# EAGLE design nanoDimmerTouchPad (EAGLE 9.4.2)
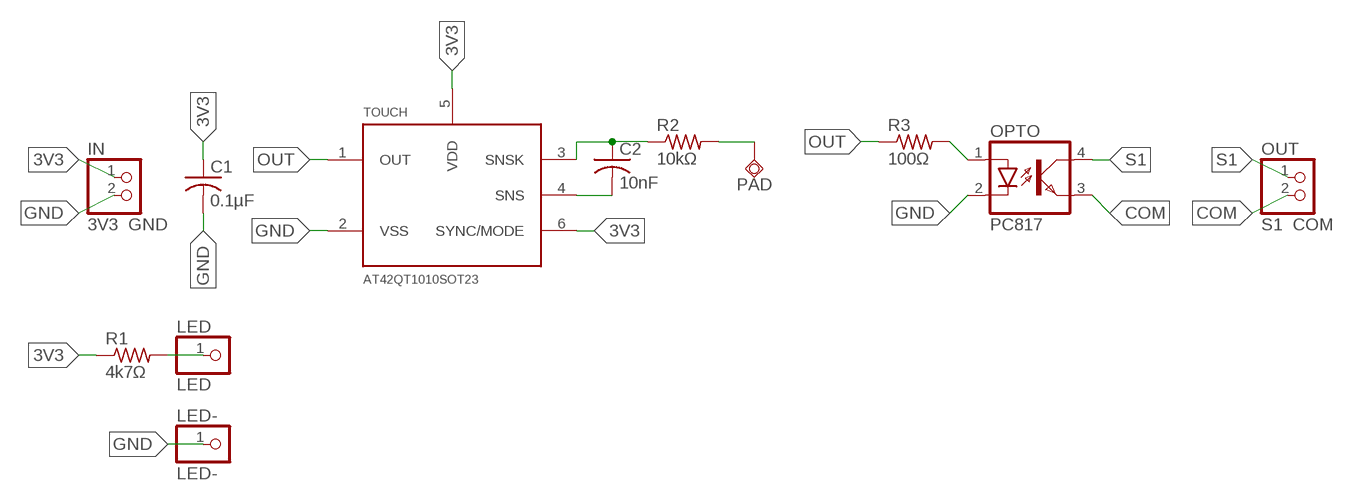
[diagram p0: schematic, sheet 1]

## Parts
C1  0.1µF  C-USC1206  [C1206]
C2  10nF  C-USC1206  [C1206]
IN  3V3 GND  PINHD-1X2  [1X02]
LED  LED  PINHD-1X1  [1X01]
LED-  LED-  PINHD-1X1  [1X01]
OPTO  PC817  [DIL04]
OUT  S1 COM  PINHD-1X2  [1X02]
PAD  TPSQPAD1-13  [P1-13]
R1  4k7Ω  R-US_R1206  [R1206]
R2  10kΩ  R-US_R1206  [R1206]
R3  100Ω  R-US_R1206  [R1206]
TOUCH  AT42QT1010SOT23  [SOT23-6]

## Nets
3V3: C1.1 IN.1 R1.1 TOUCH.5(VDD) TOUCH.6(SYNC/MODE)
COM: OPTO.3(EMIT) OUT.2
GND: C1.2 IN.2 LED-.1 OPTO.2(C) TOUCH.2(VSS)
LED: LED.1 R1.2
OPTO: OPTO.1(A) R3.2
OUT: R3.1 TOUCH.1(OUT)
PAD: PAD.TP R2.2
S1: OPTO.4(COL) OUT.1
SNS: C2.2 TOUCH.4(SNS)
SNSK: C2.1 R2.1 TOUCH.3(SNSK)

## Library data of the parts
C1 C2 = rcl:C-US: CAPACITOR, American symbol; SPICEPREFIX: C
IN OUT = pinhead:PINHD-1X2: PIN HEADER
LED LED- = pinhead:PINHD-1X1: PIN HEADER
OPTO = optocoupler:PC817: SHARP OPTO COUPLER; MPN: PC817X4J000F; OC_FARNELL: 9707727; OC_NEWARK: 97K7059
PAD = testpad:TPSQ: Test pad
R1-R3 = rcl:R-US_: RESISTOR, American symbol; SPICEPREFIX: R
TOUCH = SparkFun-Retired:AT42QT1010

## Board
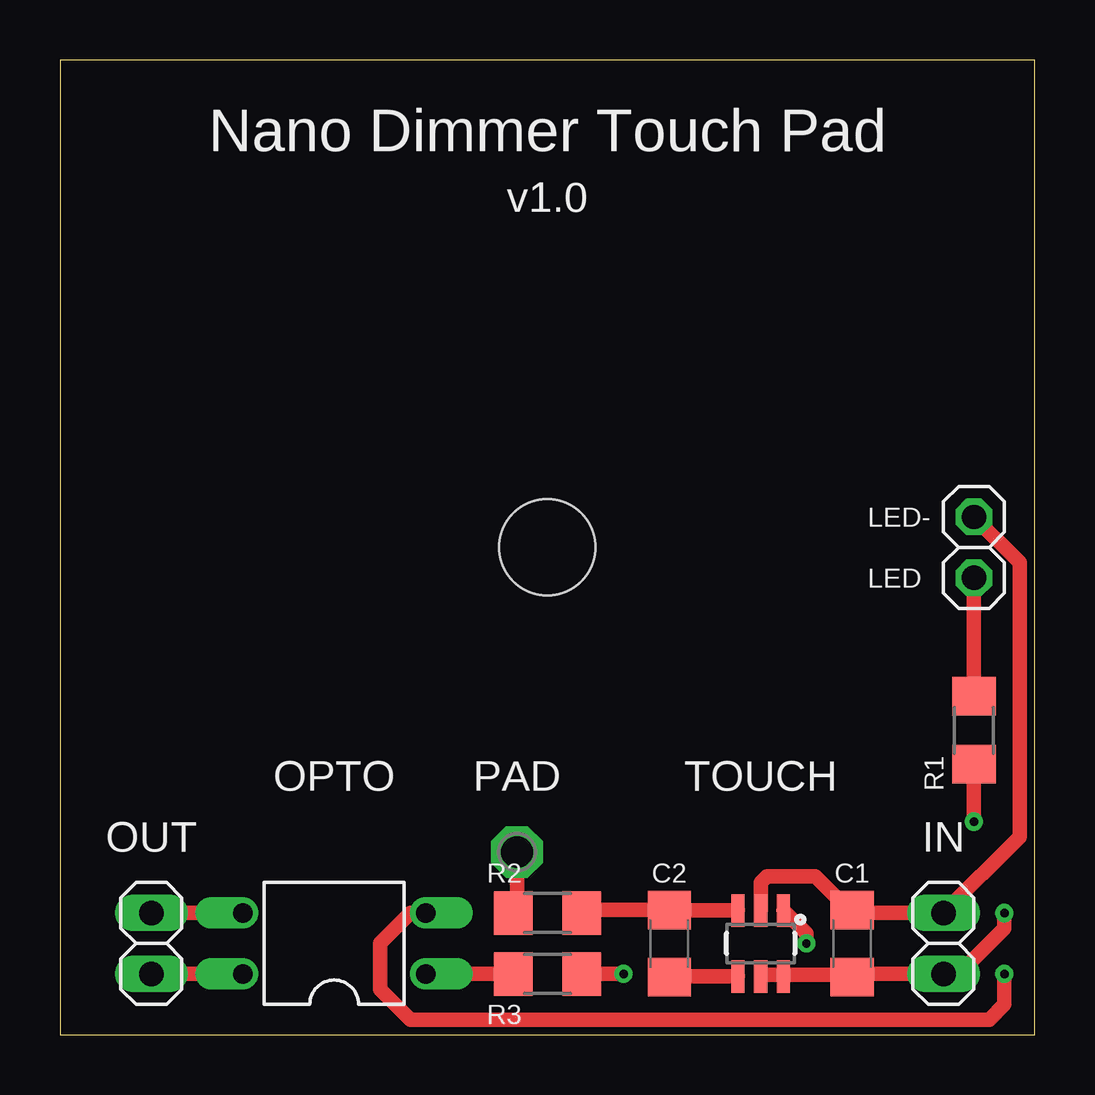
[diagram p1: board, top side]
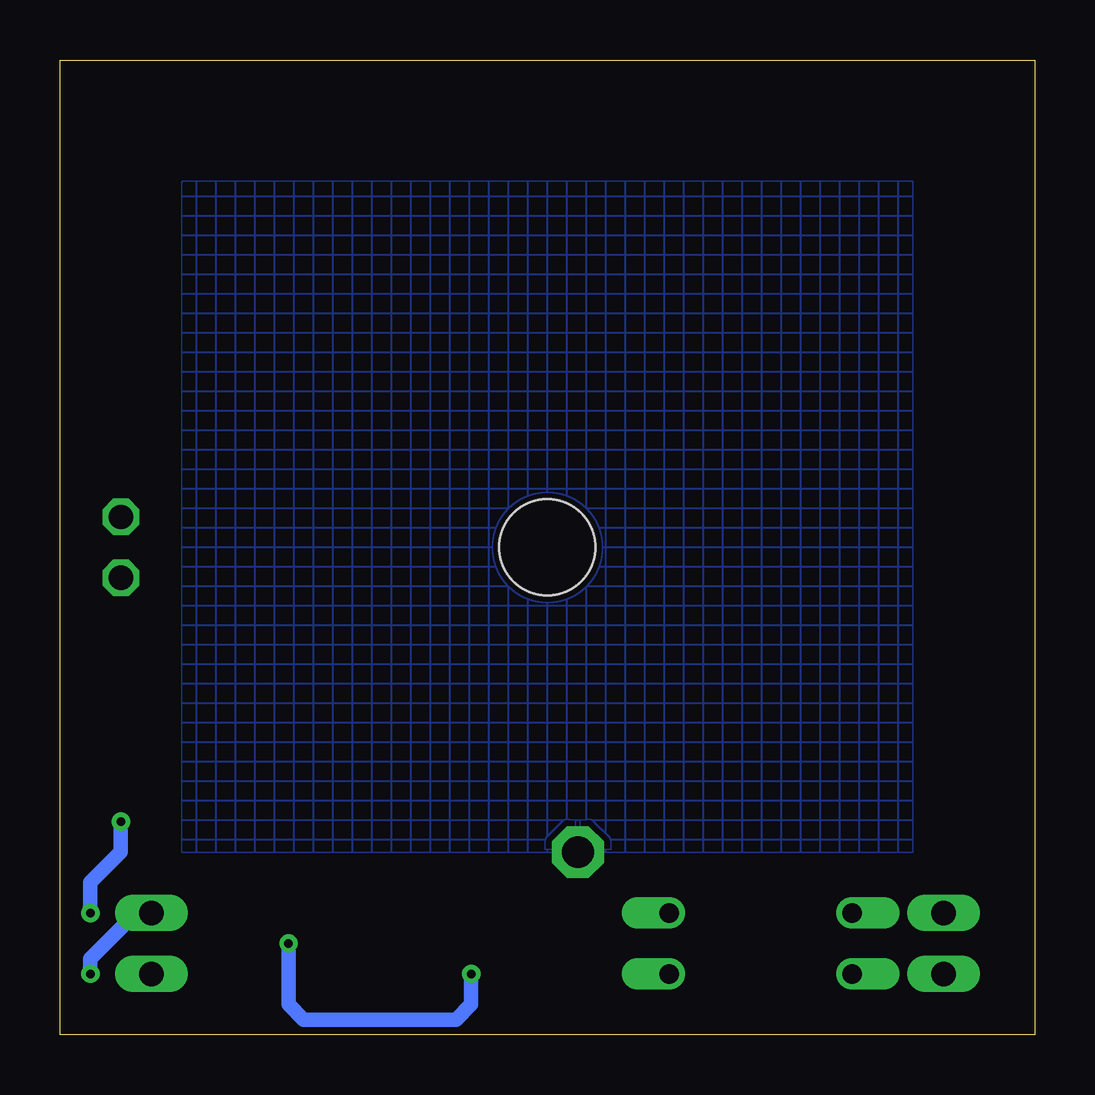
[diagram p2: board, bottom side, seen from below]

Size 40.64 x 40.64 mm. Coordinates in mm from the lower left corner, seen from the top.
Outline: 0,0 40.64,0 40.64,40.64 0,40.64 0,0
Copper layers (1*16): Top 0.035mm / dielectric 1.5mm / Bottom 0.035mm
Design rules "default *": minimum track width 6mil, minimum drill 0.35mm, track to track 6mil, track to pad 6mil, pad to pad 6mil, via to via 6mil, smd to smd 6mil, copper to edge 10mil, drill to drill 6mil, minimum pad ring 10mil, minimum via ring 8mil, stop-mask expansion 4mil, vias tented up to drill 0mil, thermal gap 10mil
Holes 4 mm at 20.32,20.32

### Footprints (pad centres in the part's own frame; a part is rotated, then mirrored left to right if it is on the bottom)
C1206 = smd 1.6 x 1.8: 1 -1.4,0; 2 1.4,0
1X02 = drill 1.016 long: 1 -1.27,0; 2 1.27,0
1X01 = drill 1.016 octagon: 1 0,0
DIL04 = drill 0.813 offset: 1 -1.27,-3.81; 2 1.27,-3.81; 3 1.27,3.81; 4 -1.27,3.81
P1-13 = drill 1.321 pad 2.159 octagon: TP 0,0
R1206 = smd 1.6 x 1.803: 1 -1.422,0; 2 1.422,0
SOT23-6 = smd 0.55 x 1.35: 1 -0.95,-1.375; 2 0,-1.375; 3 0.95,-1.375; 4 0.95,1.375; 5 0,1.375; 6 -0.95,1.375

### Placement (x,y rotation side)
C1  33.02,3.81 90 top
C2  25.4,3.81 270 top
IN  36.83,3.81 90 top
LED  38.1,19.05 0 top
LED-  38.1,21.59 0 top
OPTO  11.43,3.81 90 top
OUT  3.81,3.81 90 top
PAD  19.05,7.62 0 top
R1  38.1,12.7 90 top
R2  20.32,5.08 180 top
R3  20.32,2.54 180 top
TOUCH  29.21,3.81 180 top

### Tracks (layer width: path | path; a pad name or v marks a point on that pad's centre or on a via)
3V3  (via drill 0.35)
  Top 0.61: C1.1 32.92,2.51 30.23,2.51 | v38.1,8.89 R1.1 | 33.15,2.54 IN.1 37.47,2.54 39.37,4.45 v39.37,5.08 | 30.23,2.51 TOUCH.6 | TOUCH.5 29.29,2.51 30.23,2.51
  Top 1.27: 33.15,2.54 C1.1
  Bottom 0.61: v39.37,5.08 39.37,6.35 38.1,7.62 v38.1,8.89
COM
  Top 0.61: OPTO.3 OUT.2
GND  (via drill 0.35)
  Top 0.61: TOUCH.2 29.21,6.35 29.46,6.6 31.5,6.6 33.02,5.08 33.15,5.08 IN.2 40.01,8.26 40.01,19.68 LED-.1 | v39.37,2.54 39.37,1.27 38.73,0.64 14.61,0.64 13.34,1.91 13.34,3.81 14.61,5.08 OPTO.2
  Top 1.27: 33.15,5.08 C1.2
  Bottom 0.61: IN.2 37.47,5.08 39.37,3.17 v39.37,2.54
LED
  Top 0.61: R1.2 LED.1
OPTO
  Top 0.61: R3.2 OPTO.1
OUT  (via drill 0.35)
  Top 0.61: TOUCH.1 31.11,4.23 v31.11,3.81 | R3.1 v23.5,2.54
  Bottom 0.61: v31.11,3.81 31.11,1.27 30.48,0.64 24.13,0.64 23.5,1.27 v23.5,2.54
PAD
  Top 0.61: R2.2 19.05,5.23 PAD.TP
  pour Bottom (hatched): 35.56,7.62 5.08,7.62 5.08,35.56 35.56,35.56
S1
  Top 0.61: OPTO.4 OUT.1
SNS
  Top 0.61: C2.2 25.5,2.51 25.57,2.44 TOUCH.4
SNSK
  Top 0.61: R2.1 21.87,5.21 C2.1 25.5,5.11 25.57,5.18 TOUCH.3

### Text on the board
tNames: Nano Dimmer Touch Pad | v1.0